# Altium schematic sheet ADC.SchDoc
size A4; SheetNumber: 4; SheetTotal: 7
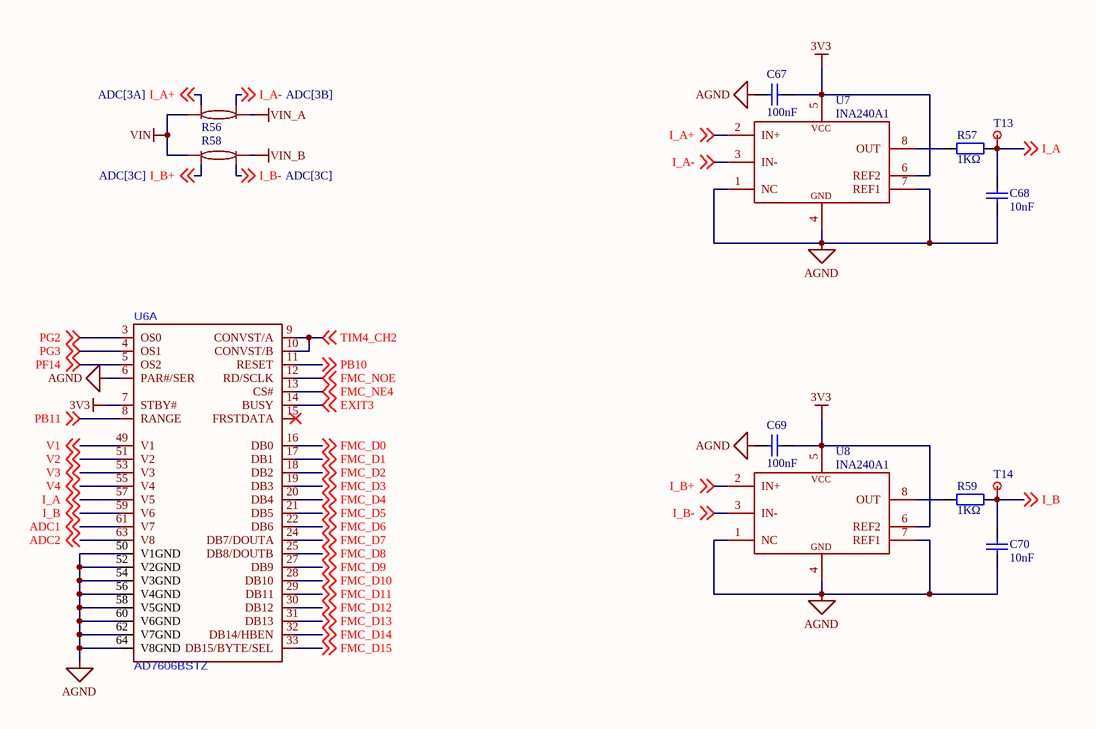
[diagram p0: ADC.SchDoc]

## Parts
C67  100nF  [0402_C]
C68  10nF  [0402_C]
C69  100nF  [0402_C]
C70  10nF  [0402_C]
R56  1206_2mR_1W  [1206_2mΩ_1W]  (value not drawn)
R57  1KΩ  [0402_R]
R58  1206_2mR_1W  [1206_2mΩ_1W]  (value not drawn)
R59  1KΩ  [0402_R]
T13  testpoint  [testpoint]  (value not drawn)
T14  testpoint  [testpoint]  (value not drawn)
U6  AD7606BSTZ  [LQFP-64_L10.0-W10.0-P0.50-LS12.0-TL]  (part A of 2)
U7  INA240A1  [TSSOP8]
U8  INA240A1  [TSSOP8]

## Nets
3V3: C67.1 C69.1 U6.7(STBY#) U7.5(VS) U7.6(REF2) U8.5(VS) U8.6(REF2)
AGND: C67.2 C68.2 C69.2 C70.2 U6.6(PAR#/SER) U6.50(V1GND) U6.52(V2GND) U6.54(V3GND) U6.56(V4GND) U6.58(V5GND) U6.60(V6GND) U6.62(V7GND) U6.64(V8GND) U7.1(NC) U7.4(GND) U7.7(REF1) U8.1(NC) U8.4(GND) U8.7(REF1)
VIN: R56.1 R58.1
VIN_A: R56.2
VIN_B: R58.2
ADC1: U6.61(V7) ; off-sheet ADC1
ADC2: U6.63(V8) ; off-sheet ADC2
EXIT3: U6.14(BUSY) ; off-sheet EXIT3
FMC_D0: U6.16(DB0) ; off-sheet FMC_D0
FMC_D1: U6.17(DB1) ; off-sheet FMC_D1
FMC_D2: U6.18(DB2) ; off-sheet FMC_D2
FMC_D3: U6.19(DB3) ; off-sheet FMC_D3
FMC_D4: U6.20(DB4) ; off-sheet FMC_D4
FMC_D5: U6.21(DB5) ; off-sheet FMC_D5
FMC_D6: U6.22(DB6) ; off-sheet FMC_D6
FMC_D7: U6.24(DB7/DOUTA) ; off-sheet FMC_D7
FMC_D8: U6.25(DB8/DOUTB) ; off-sheet FMC_D8
FMC_D9: U6.27(DB9) ; off-sheet FMC_D9
FMC_D10: U6.28(DB10) ; off-sheet FMC_D10
FMC_D11: U6.29(DB11) ; off-sheet FMC_D11
FMC_D12: U6.30(DB12) ; off-sheet FMC_D12
FMC_D13: U6.31(DB13) ; off-sheet FMC_D13
FMC_D14: U6.32(DB14/HBEN) ; off-sheet FMC_D14
FMC_D15: U6.33(DB15/BYTE/SEL) ; off-sheet FMC_D15
FMC_NE4: U6.13(CS#) ; off-sheet FMC_NE4
FMC_NOE: U6.12(RD/SCLK) ; off-sheet FMC_NOE
I_A: C68.1 R57.1 T13.1(R) U6.57(V5) ; off-sheet I_A
I_A+: R56.3 U7.2(IN+) ; off-sheet I_A+
I_A-: R56.4 U7.3(IN-) ; off-sheet I_A-
I_B: C70.1 R59.1 T14.1(R) U6.59(V6) ; off-sheet I_B
I_B+: R58.3 U8.2(IN+) ; off-sheet I_B+
I_B-: R58.4 U8.3(IN-) ; off-sheet I_B-
PB10: U6.11(RESET) ; off-sheet PB10
PB11: U6.8(RANGE) ; off-sheet PB11
PF14: U6.5(OS2) ; off-sheet PF14
PG2: U6.3(OS0) ; off-sheet PG2
PG3: U6.4(OS1) ; off-sheet PG3
TIM4_CH2: U6.9(CONVST/A) U6.10(CONVST/B) ; off-sheet TIM4_CH2
V1: U6.49(V1) ; off-sheet V1
V2: U6.51(V2) ; off-sheet V2
V3: U6.53(V3) ; off-sheet V3
V4: U6.55(V4) ; off-sheet V4
NetR57_2: R57.2 U7.8(OUT)
NetR59_2: R59.2 U8.8(OUT)

Not connected (* = marked no-connect by the designer): U6 15(FRSTDATA)*

## Notes on the sheet
- (in symbol INA240Ax) VCC

## Library data of the parts
C67-C70 = 0402 100nF (104) 10% 16V: 贴片电容; ComponentLink1Description: 供应商链接; ComponentLink1URL: http://www.szlcsc.com/product/details_1877.html; Package: 0402; Supplier: LC; SuppliersPartNumber: C1525
R57 R59 = 0402 0Ω (0R0) 1%: 贴片电阻; ComponentLink1Description: 供应商链接; ComponentLink1URL: http://www.szlcsc.com/product/details_17853.html; Package: 0402; Supplier: LC; SuppliersPartNumber: C17168
U7 U8 = INA240Ax: 电流放大器; 厂家: TI